# Altium schematic sheet M5_Camera.SchDoc
size A; SheetNumber: 5; SheetTotal: 5
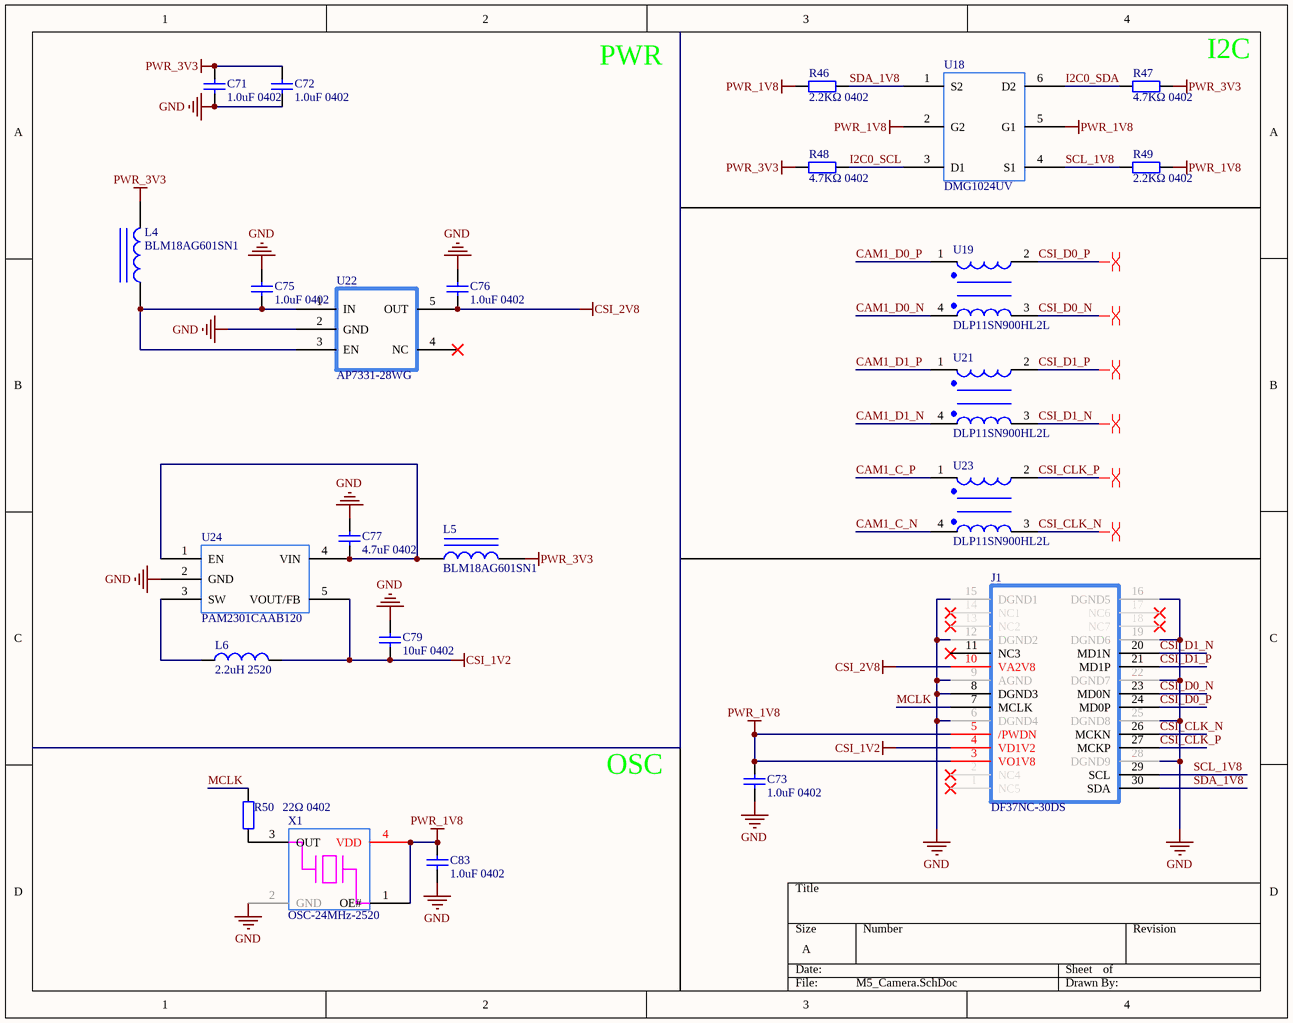
[diagram p0: M5_Camera.SchDoc]

## Parts
C71  1.0uF 0402  [0402_C]
C72  1.0uF 0402  [0402_C]
C73  1.0uF 0402  [0402_C]
C75  1.0uF 0402  [0402_C]
C76  1.0uF 0402  [0402_C]
C77  4.7uF 0402  [0402_C]
C79  10uF 0402  [0402_C]
C83  1.0uF 0402  [0402_C]
J1  DF37NC-30DS  [DF37NF-30DS]
L4  BLM18AG601SN1  [0603_L]
L5  BLM18AG601SN1  [0603_L]
L6  2.2uH 2520  [2.2uH 2520]
R46  2.2KΩ 0402  [0402_R]
R47  4.7KΩ 0402  [0402_R]
R48  4.7KΩ 0402  [0402_R]
R49  2.2KΩ 0402  [0402_R]
R50  22Ω 0402  [0402_R]
U18  DMG1024UV  [DMG1024UV]
U19  DLP11SN900HL2L  [DLP11SN900HL2L]
U21  DLP11SN900HL2L  [DLP11SN900HL2L]
U22  AP7331-28WG  [AP7331-28WG]
U23  DLP11SN900HL2L  [DLP11SN900HL2L]
U24  PAM2301CAAB120  [PAM2301CAAB120]
X1  OSC-24MHz-2520  [OSC-24MHz-2520]

## Nets
CSI_1V2: C79.2 J1.4(VD1V2) L6.2 U24.5(VOUT/FB)
CSI_2V8: C76.1 J1.10(VA2V8) U22.5(OUT)
GND: C71.1 C72.1 C73.1 C75.2 C76.2 C77.2 C79.1 C83.1 J1.6(DGND4) J1.8(DGND3) J1.9(AGND) J1.12(DGND2) J1.15(DGND1) J1.16(DGND5) J1.19(DGND6) J1.22(DGND7) J1.25(DGND8) J1.28(DGND9) U22.2(GND) U24.2(GND) X1.2(GND)
PWR_1V8: C73.2 C83.2 J1.3(VO1V8) J1.5(/PWDN) R46.1 R49.2 U18.2(G2) U18.5(G1) X1.1(OE#) X1.4(VDD)
PWR_3V3: C71.2 C72.2 L4.2 L5.2 R47.2 R48.1
CAM1_C_N: U23.4
CAM1_C_P: U23.1
CAM1_D0_N: U19.4
CAM1_D0_P: U19.1
CAM1_D1_N: U21.4
CAM1_D1_P: U21.1
CSI_CLK_N: J1.26(MCKN) U23.3
CSI_CLK_P: J1.27(MCKP) U23.2
CSI_D0_N: J1.23(MD0N) U19.3
CSI_D0_P: J1.24(MD0P) U19.2
CSI_D1_N: J1.20(MD1N) U21.3
CSI_D1_P: J1.21(MD1P) U21.2
I2C0_SCL: R48.2 U18.3(D1)
I2C0_SDA: R47.1 U18.6(D2)
MCLK: J1.7(MCLK) R50.1
SCL_1V8: J1.29(SCL) R49.1 U18.4(S1)
SDA_1V8: J1.30(SDA) R46.2 U18.1(S2)
NetC75_1: C75.1 L4.1 U22.1(IN) U22.3(EN)
NetC77_1: C77.1 L5.1 U24.1(EN) U24.4(VIN)
NetL6_1: L6.1 U24.3(SW)
NetR50_2: R50.2 X1.3(OUT)

Not connected (* = marked no-connect by the designer): J1 1(NC5)* 2(NC4)* 11(NC3)* 13(NC2)* 14(NC1)* 17(NC6)* 18(NC7)*; U22 4(NC)*

## Layout directives
differential pair: CSI_CLK_N, CSI_CLK_P, CSI_D0_N, CSI_D0_P, CSI_D1_N, CSI_D1_P

## Notes on the sheet
- PWR
- (near R47) I2C
- OSC

## Library data of the parts
C71-C73 C75 C76 C83 = 0402 1.0uF (105) 10% 25V: 贴片电容; ComponentLink1Description: 供应商链接; ComponentLink1URL: http://www.szlcsc.com/product/details_53938.html; Package: 0402; Supplier: LC; SuppliersPartNumber: C52923
C77 = 0402 4.7uF (475) 20% 10V: 贴片电容; ComponentLink1Description: 供应商链接; ComponentLink1URL: http://www.szlcsc.com/product/details_24469.html; Package: 0402; Supplier: LC; SuppliersPartNumber: C23733
C79 = 0402 10uF (106) 20% 6.3V: 贴片电容; ComponentLink1Description: 供应商链接; ComponentLink1URL: http://www.szlcsc.com/product/details_16204.html; Package: 0402; Supplier: LC; SuppliersPartNumber: C15525
J1 = DF37NC-30DS: Camera Connector
L4 L5 = 0603 10uH 10%: 贴片电感; ComponentLink1Description: 供应商链接; ComponentLink1URL: http://www.szlcsc.com/product/details_1387.html; Package: 0603; Supplier: LC; SuppliersPartNumber: C1035
L6 = 2.2uH 2520: 2520; MP: DFE252008U-2R2M=P2; Package: None; Price: None; Value: *; Availability: Unavailable
R46 R49 = 0402 2.2KΩ (2201) 1%: 贴片电阻; ComponentLink1Description: 供应商链接; ComponentLink1URL: http://www.szlcsc.com/product/details_26622.html; Package: 0402; Supplier: LC; SuppliersPartNumber: C25879
R47 R48 = 0402 4.7KΩ (4701) 1%: 贴片电阻; ComponentLink1Description: 供应商链接; ComponentLink1URL: http://www.szlcsc.com/product/details_26643.html; Package: 0402; Supplier: LC; SuppliersPartNumber: C25900
R50 = 0402 22Ω (22R0) 1%: 贴片电阻; ComponentLink1Description: 供应商链接; ComponentLink1URL: http://www.szlcsc.com/product/details_25835.html; Package: 0402; Supplier: LC; SuppliersPartNumber: C25092
U18 = DMG1024UV: Camera
U19 U21 U23 = DLP11SN900HL2L: Camera
U22 = AP7331-28WG: Camera 2.8V
U24 = PAM2301CAAB120: Camera 1.2V
X1 = OSC-24MHz-2520: 24MHz Camera